# Altium schematic sheet JUMPERS.SchDoc
size A4
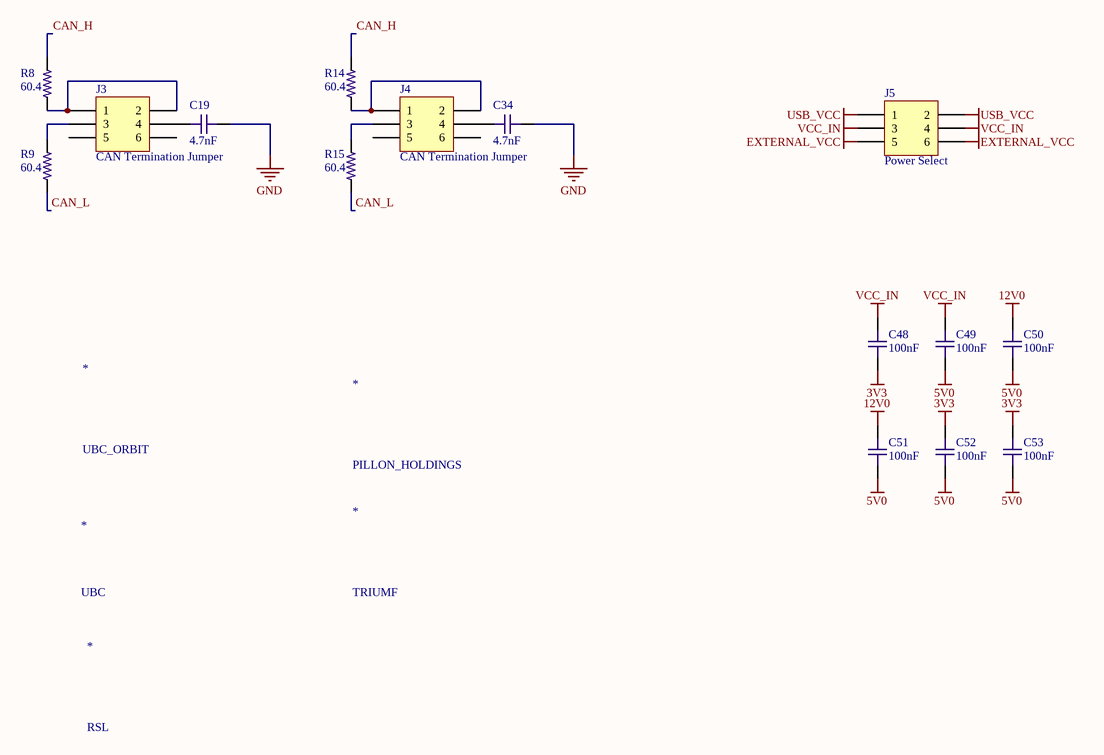
[diagram p0: JUMPERS.SchDoc]

## Parts
(Parts that share a designator on the sheet are numbered #1, #2 ... from top to bottom, then left to right.)
*#1  UBC_ORBIT  [UBC_ORBIT]
*#2  PILLON_HOLDINGS  [PILLON_HOLDINGS]
*#3  UBC  [UBC]
*#4  TRIUMF  [TRIUMF]
*#5  RSL  [RSL]
?  CSA  [CSA]  (value not drawn)
C19  value 4.7nF  [C0603-IPC]  (hidden comment: 0603 Capacitor Template)
C34  value 4.7nF  [C0603-IPC]  (hidden comment: 0603 Capacitor Template)
C48  value 100nF  [C0603-IPC]  (hidden comment: Capacitor)
C49  value 100nF  [C0603-IPC]  (hidden comment: Capacitor)
C50  value 100nF  [C0603-IPC]  (hidden comment: Capacitor)
C51  value 100nF  [C0603-IPC]  (hidden comment: Capacitor)
C52  value 100nF  [C0603-IPC]  (hidden comment: Capacitor)
C53  value 100nF  [C0603-IPC]  (hidden comment: Capacitor)
J3  CAN Termination Jumper  [HDR2X3]
J4  CAN Termination Jumper  [HDR2X3]
J5  Power Select  [HDR2X3]
R8  value 60.4  [R2512-IPC]  (hidden comment: 2512 Template)
R9  value 60.4  [R2512-IPC]  (hidden comment: 2512 Template)
R14  value 60.4  [R2512-IPC]  (hidden comment: 2512 Template)
R15  value 60.4  [R2512-IPC]  (hidden comment: 2512 Template)

## Nets
3V3: C48.1 C52.2 C53.2
5V0: C49.1 C50.1 C51.1 C52.1 C53.1
12V0: C50.2 C51.2
EXTERNAL_VCC: J5.5 J5.6
GND: C19.2 C34.2
USB_VCC: J5.1 J5.2
VCC_IN: C48.2 C49.2 J5.3 J5.4
CAN_H: R8.2 R14.2
CAN_L: R9.1 R15.1
NetC19_1: C19.1 J3.4
NetC34_1: C34.1 J4.4
NetJ3_1: J3.1 J3.2 R8.1
NetJ3_3: J3.3 R9.2
NetJ4_1: J4.1 J4.2 R14.1
NetJ4_3: J4.3 R15.2

Not connected (* = marked no-connect by the designer): J3 5 6; J4 5 6

## Library data of the parts
*#1 = 3: UBC Orbit Logo; OrbitPartId: 3; PartId: 0; Type: Silkscreen; Subtype: Logo
*#2 = 7: Pillon Holdings Logo; OrbitPartId: 7; PartId: 0; Type: Silkscreen; Subtype: Logo
*#3 = 5: UBC Logo; OrbitPartId: 5; PartId: 0; Type: Silkscreen; Subtype: Logo
*#4 = 8: TRIUMF Logo; OrbitPartId: 8; PartId: 0; Type: Silkscreen; Subtype: Logo
*#5 = 6: RSL Logo; OrbitPartId: 6; PartId: 0; Type: Silkscreen; Subtype: Logo
? = 9: CSA Logo; OrbitPartId: 9; PartId: 0; Type: Silkscreen; Subtype: Logo
C19 C34 = 0603 Capacitor Template: Chip Capacitor, 0603, ??nF, 10V, X7R; EIA Code: X7R; Max. Voltage: 10V
C48-C53 = 13: Chip Capacitor, 0603, 100nF, 10V, X7R; OrbitPartId: 13; Type: Passive; EIA Code: X7R; Max. Voltage: 10V; PartId: 1; Subtype: Capacitor
J3-J5 = Header 3X2: Header, 3-Pin, Dual row; LatestRevisionDate: 17-Jul-2002; LatestRevisionNote: Re-released for DXP Platform.; Publisher: Altium Limited
R8 R9 R14 R15 = 2512 Template: Chip Resistor, 2515, ??k ohms